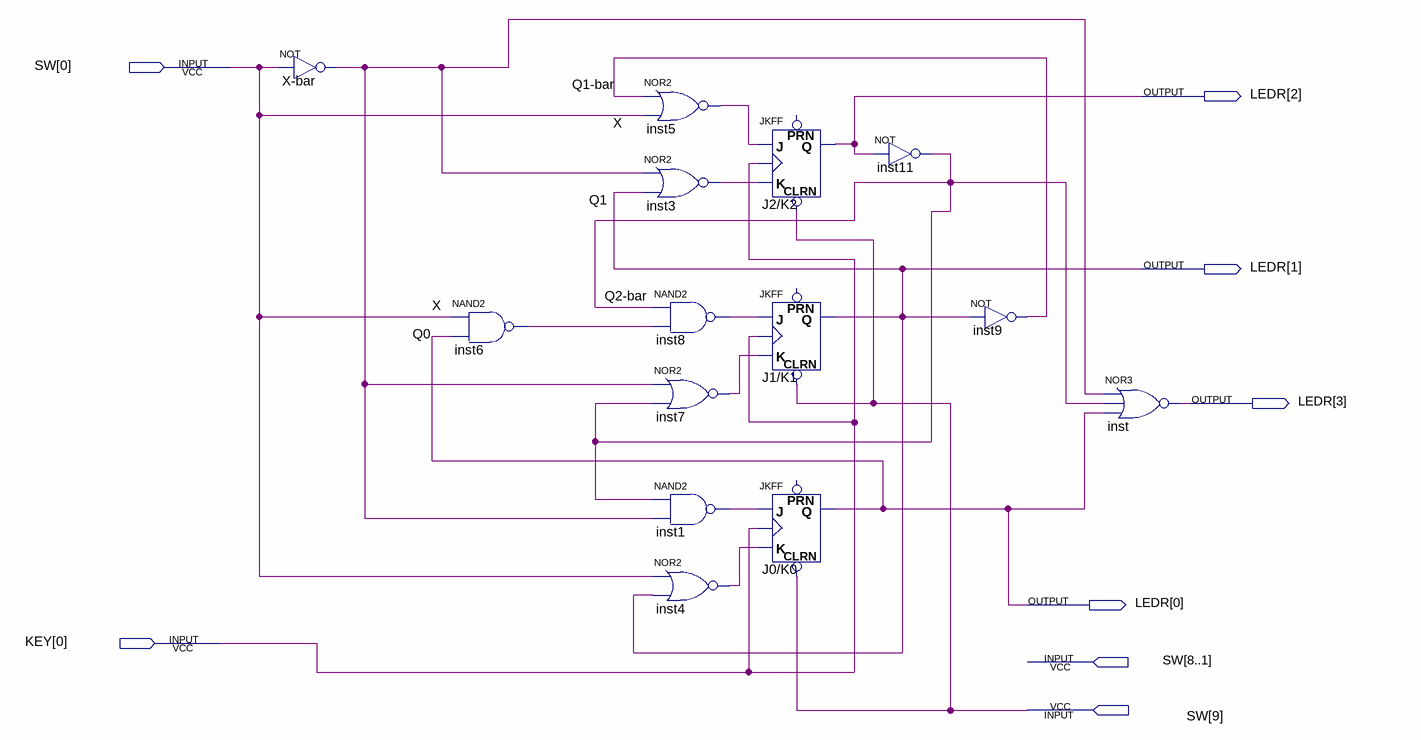
[diagram p0: schematic sheet]
// Quartus schematic lab2.bdf as structural Verilog: 14 symbols, 8 pins
module lab2 (
  input  [9:0] SW,
  input  [0:0] KEY,
  output [3:0] LEDR
);

  wire inst1_out, inst3_out, inst4_out, inst5_out, inst6_out, inst7_out, inst8_out, \Q1-bar , \Q2-bar ,
       X_bar_out;

  not \X-bar  (X_bar_out, SW[0]);
  nand inst6 (inst6_out, SW[0], LEDR[0]);
  nor inst5 (inst5_out, \Q1-bar , SW[0]);
  nor inst3 (inst3_out, X_bar_out, LEDR[1]);
  nand inst8 (inst8_out, \Q2-bar , inst6_out);
  nor inst7 (inst7_out, X_bar_out, \Q2-bar );
  nand inst1 (inst1_out, \Q2-bar , X_bar_out);
  nor inst4 (inst4_out, SW[0], LEDR[1]);
  JKFF \J2/K2  (.CLRN(SW[9]), .K(inst3_out), .J(inst5_out), .CLK(KEY[0]), .Q(LEDR[2]));  // open: PRN
  JKFF \J1/K1  (.CLRN(SW[9]), .K(inst7_out), .J(inst8_out), .CLK(KEY[0]), .Q(LEDR[1]));  // open: PRN
  JKFF \J0/K0  (.CLRN(SW[9]), .K(inst4_out), .J(inst1_out), .CLK(KEY[0]), .Q(LEDR[0]));  // open: PRN
  not inst11 (\Q2-bar , LEDR[2]);
  not inst9 (\Q1-bar , LEDR[1]);
  nor inst (LEDR[3], X_bar_out, \Q2-bar , LEDR[0]);

  // Other names for the same wires on the sheet: Q0 = LEDR[0]; Q1 = LEDR[1]; X = SW[0]
endmodule
